# Altium schematic sheet WS281x.SchDoc
size A
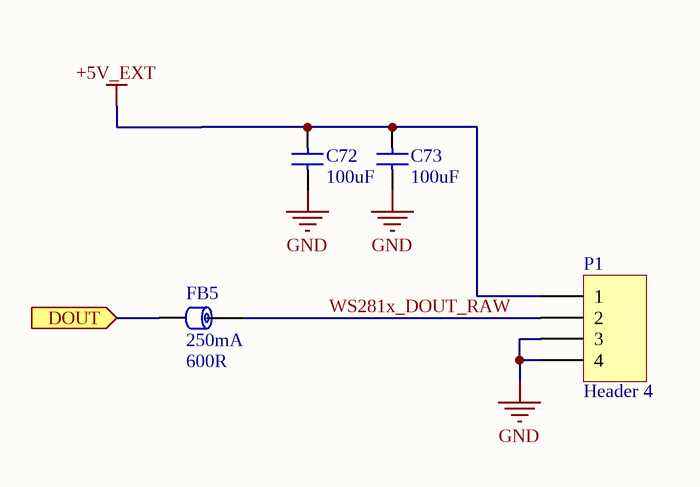
[diagram p0: WS281x.SchDoc]

## Parts
C72  value 100uF  [1210_Capacitor]  (hidden comment: C3225X5R0J107M250AC)
C73  value 100uF  [1210_Capacitor]  (hidden comment: C3225X5R0J107M250AC)
FB5  value 600R  Current Rating: 250mA  [0402_Inductor]  (hidden comment: BK1005HM601-T)
P1  Header 4  [HDR1X4]

## Ports
DOUT (in)

## Nets
+5V_EXT: C72.1 C73.1 P1.1
GND: C72.2 C73.2 P1.3 P1.4
DOUT: FB5.1 ; port DOUT
WS281x_DOUT_RAW: FB5.2 P1.2

## Library data of the parts
C72 C73 = C_1210_100uF_6.3V_20%: CAP CER 100UF 6.3V 20% X5R 1210; SVP Creator: Spencer Berglund; Package: 1210; Supplier 1: Digi-Key; Supplier Part Number 1: 445-1437-1-ND
FB5 = FB_0402_600R_250mA: 600 Ohms @ 100MHz 1 Ferrite Bead 0402 (1005 Metric) 250mA 500mOhm; Manufacturer: Taiyo Yuden; DC Resistance (DCR): 500mR; Frequency: 100MHz; Supplier 1: Digi-Key; Supplier Part Number 1: 490-9702-1-ND; Manufacturer Part Number: BK1005HM601-T; Max Operating Temperature: 125°C; Min Operating Temperature: -55°C
P1 = Header 4: Header, 4-Pin; LatestRevisionDate: 17-Jul-2002; LatestRevisionNote: Re-released for DXP Platform.; Publisher: Altium Limited